# Altium schematic sheet SDMMC EMMC PCIE ADC Blocks.SchDoc
size 420 x 297 mm; SheetNumber: 6; SheetTotal: 26
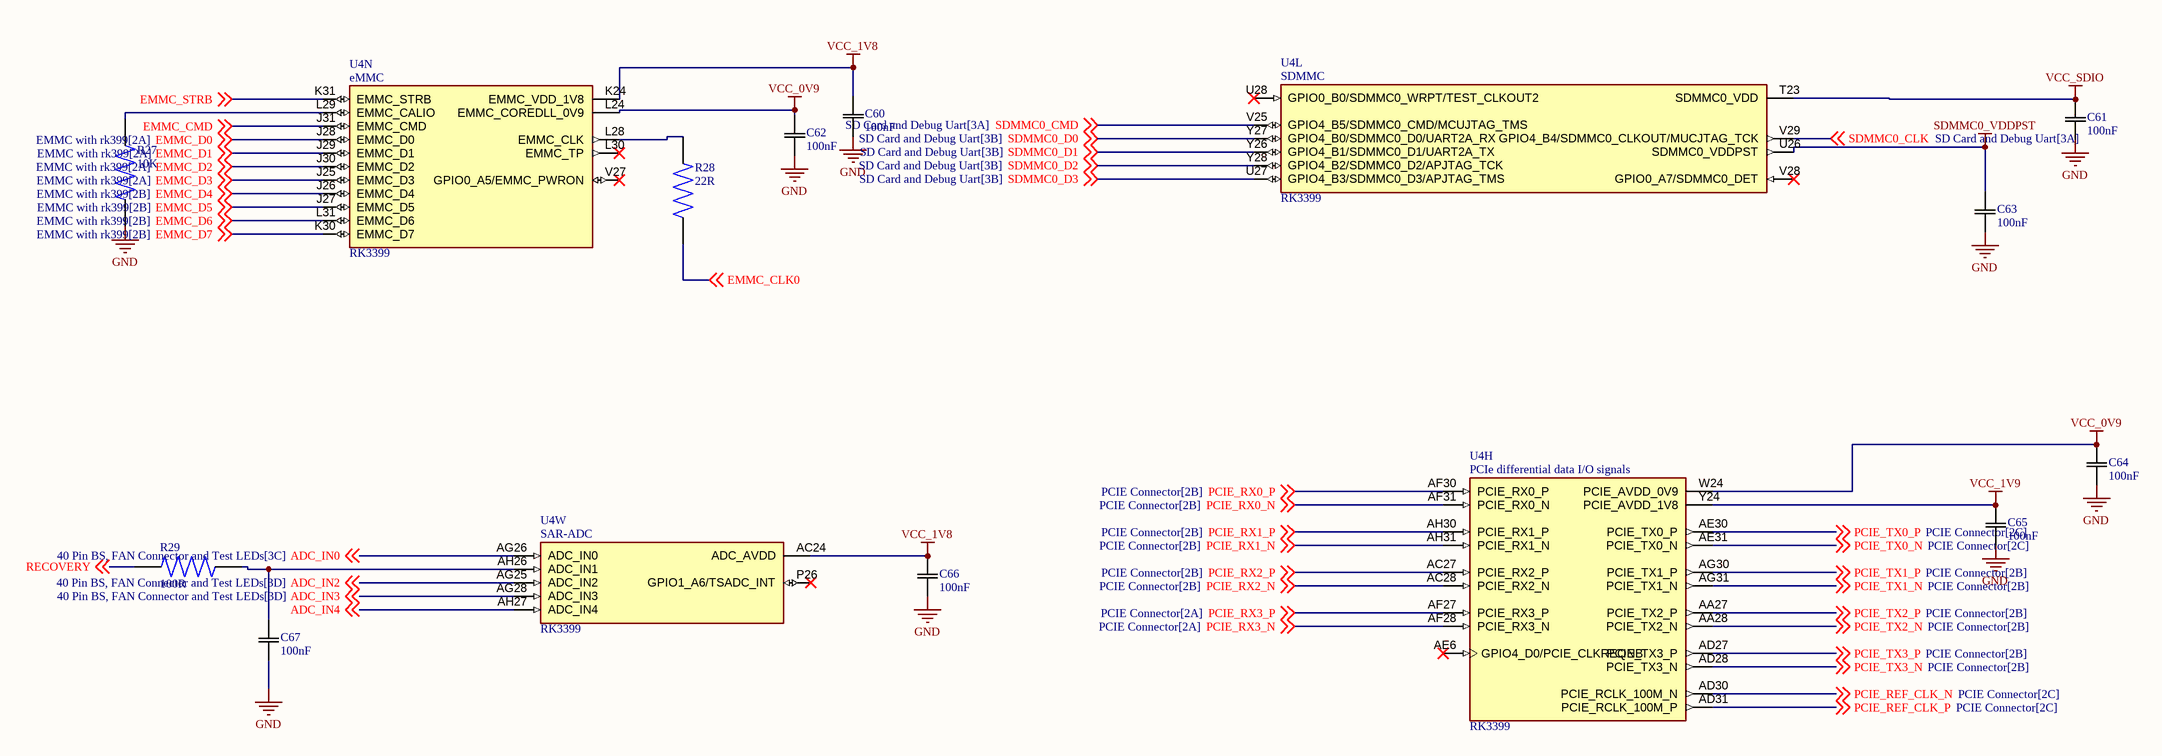
[diagram p0: SDMMC EMMC PCIE ADC Blocks.SchDoc]

## Parts
C60  100nF  [CAP_1005_TDK]
C61  100nF  [CAP_1005_TDK]
C62  100nF  [CAP_1005_TDK]
C63  100nF  [CAP_1005_TDK]
C64  100nF  [CAP_1005_TDK]
C65  100nF  [CAP_1005_TDK]
C66  100nF  [CAP_1005_TDK]
C67  100nF  [CAP_1005_TDK]
R27  10K  [RESC1608X55N]
R28  22R  [RES_ERJXGNJ220Y]
R29  100R  [RES_ERA6AHD330V]
U4  RK3399  [BGA828C65P31X31_2100X2100X161N]  (parts H,L,N,W of 32)

## Nets
GND: C60.2 C61.2 C62.2 C63.2 C64.2 C65.2 C66.2 C67.2 R27.1
SDMMC0_VDDPST: C63.1 U4.U26(SDMMC0_VDDPST)
VCC_0V9: C62.1 C64.1 U4.L24(EMMC_COREDLL_0V9) U4.W24(PCIE_AVDD_0V9)
VCC_1V8: C60.1 C66.1 U4.AC24(ADC_AVDD) U4.K24(EMMC_VDD_1V8)
VCC_1V9: C65.1 U4.Y24(PCIE_AVDD_1V8)
VCC_SDIO: C61.1 U4.T23(SDMMC0_VDD)
ADC_IN0: U4.AG26(ADC_IN0) ; off-sheet ADC_IN0
ADC_IN2: U4.AG25(ADC_IN2) ; off-sheet ADC_IN2
ADC_IN3: U4.AG28(ADC_IN3) ; off-sheet ADC_IN3
ADC_IN4: U4.AH27(ADC_IN4) ; off-sheet ADC_IN4
EMMC_CLK0: R28.1 ; off-sheet EMMC_CLK0
EMMC_CMD: U4.J31(EMMC_CMD) ; off-sheet EMMC_CMD
EMMC_D0: U4.J28(EMMC_D0) ; off-sheet EMMC_D0
EMMC_D1: U4.J29(EMMC_D1) ; off-sheet EMMC_D1
EMMC_D2: U4.J30(EMMC_D2) ; off-sheet EMMC_D2
EMMC_D3: U4.J25(EMMC_D3) ; off-sheet EMMC_D3
EMMC_D4: U4.J26(EMMC_D4) ; off-sheet EMMC_D4
EMMC_D5: U4.J27(EMMC_D5) ; off-sheet EMMC_D5
EMMC_D6: U4.L31(EMMC_D6) ; off-sheet EMMC_D6
EMMC_D7: U4.K30(EMMC_D7) ; off-sheet EMMC_D7
EMMC_STRB: U4.K31(EMMC_STRB) ; off-sheet EMMC_STRB
PCIE_REF_CLK_N: U4.AD30(PCIE_RCLK_100M_N) ; off-sheet PCIE_REF_CLK_N
PCIE_REF_CLK_P: U4.AD31(PCIE_RCLK_100M_P) ; off-sheet PCIE_REF_CLK_P
PCIE_RX0_N: U4.AF31(PCIE_RX0_N) ; off-sheet PCIE_RX0_N
PCIE_RX0_P: U4.AF30(PCIE_RX0_P) ; off-sheet PCIE_RX0_P
PCIE_RX1_N: U4.AH31(PCIE_RX1_N) ; off-sheet PCIE_RX1_N
PCIE_RX1_P: U4.AH30(PCIE_RX1_P) ; off-sheet PCIE_RX1_P
PCIE_RX2_N: U4.AC28(PCIE_RX2_N) ; off-sheet PCIE_RX2_N
PCIE_RX2_P: U4.AC27(PCIE_RX2_P) ; off-sheet PCIE_RX2_P
PCIE_RX3_N: U4.AF28(PCIE_RX3_N) ; off-sheet PCIE_RX3_N
PCIE_RX3_P: U4.AF27(PCIE_RX3_P) ; off-sheet PCIE_RX3_P
PCIE_TX0_N: U4.AE31(PCIE_TX0_N) ; off-sheet PCIE_TX0_N
PCIE_TX0_P: U4.AE30(PCIE_TX0_P) ; off-sheet PCIE_TX0_P
PCIE_TX1_N: U4.AG31(PCIE_TX1_N) ; off-sheet PCIE_TX1_N
PCIE_TX1_P: U4.AG30(PCIE_TX1_P) ; off-sheet PCIE_TX1_P
PCIE_TX2_N: U4.AA28(PCIE_TX2_N) ; off-sheet PCIE_TX2_N
PCIE_TX2_P: U4.AA27(PCIE_TX2_P) ; off-sheet PCIE_TX2_P
PCIE_TX3_N: U4.AD28(PCIE_TX3_N) ; off-sheet PCIE_TX3_N
PCIE_TX3_P: U4.AD27(PCIE_TX3_P) ; off-sheet PCIE_TX3_P
RECOVERY: R29.1 ; off-sheet RECOVERY
SDMMC0_CLK: U4.V29(GPIO4_B4/SDMMC0_CLKOUT/MUCJTAG_TCK) ; off-sheet SDMMC0_CLK
SDMMC0_CMD: U4.V25(GPIO4_B5/SDMMC0_CMD/MCUJTAG_TMS) ; off-sheet SDMMC0_CMD
SDMMC0_D0: U4.Y27(GPIO4_B0/SDMMC0_D0/UART2A_RX) ; off-sheet SDMMC0_D0
SDMMC0_D1: U4.Y26(GPIO4_B1/SDMMC0_D1/UART2A_TX) ; off-sheet SDMMC0_D1
SDMMC0_D2: U4.Y28(GPIO4_B2/SDMMC0_D2/APJTAG_TCK) ; off-sheet SDMMC0_D2
SDMMC0_D3: U4.U27(GPIO4_B3/SDMMC0_D3/APJTAG_TMS) ; off-sheet SDMMC0_D3
NetC67_1: C67.1 R29.2 U4.AH26(ADC_IN1)
NetR27_2: R27.2 U4.L29(EMMC_CALIO)
NetR28_2: R28.2 U4.L28(EMMC_CLK)

Not connected (* = marked no-connect by the designer): U4 AE6(GPIO4_D0/PCIE_CLKREQNB)* L30(EMMC_TP)* P26(GPIO1_A6/TSADC_INT)* U28(GPIO0_B0/SDMMC0_WRPT/TEST_CLKOUT2)* V27(GPIO0_A5/EMMC_PWRON)* V28(GPIO0_A7/SDMMC0_DET)*

## Notes on the sheet
- THIS DOCUMENT AND THE DATA DISCLOSED HEREIN OR
- HEREWITH IS THE PROPERTY OF ALTIUM LIMITED AND MAY
- DWG NO:
- REVISION
- REV:
- DESCRIPTION
- DATE
- APPROVED
- BE FREELY DISTRIBUTED IN WHOLE. NO RIGHTS ARE
- RESERVED OR EXPRESS OR IMPLIED WARANTEE GIVEN.
- ENG:
- APPROVALS
- PROJECT
- DSN:
- CHK:
- REFERENCE DOCUMENTS
- PROJECT REVISION:
- TITLE
- DOCUMENT REVISION:
- DESIGN ITEM:
- BOM:
- FAB DWG:
- PCB DWG:
- ASSY DWG:
- SCALE:
- A3
- SIZE
- CAGE CODE
- FILE NAME
- DWG NO.
- SHEET
- OF
- REV
- (in symbol RK3399, part H) PCIe differential data I/O signals
- (in symbol RK3399, part L) SDMMC
- (in symbol RK3399, part N) eMMC
- (in symbol RK3399, part W) SAR-ADC

## Library data of the parts
C60-C67 = C1005X7R1H104M050BB: Description; Manufacturer_Name: TDK; Copyright: Copyright (C) 2025 Ultra Librarian. All rights reserved.; Manufacturer_Part_Number: C1005X7R1H104M050BB
R27 = CR0603AFX-1002EAS: Resistor, AS 0603 10k 1% 100mW TC100 | Bourns CR0603AFX-1002EAS; SnapEDA_Link: https://www.snapeda.com/parts/CR0603AFX-1002EAS/Bourns/view-part/?ref=snap; Package: 0603-2 Bourns; Value: *; MF: Bourns; MP: CR0603AFX-1002EAS; Check_prices: https://www.snapeda.com/parts/CR0603AFX-1002EAS/Bourns/view-part/?ref=eda
R28 = ERJXGNJ220Y: MP: ERJXGNJ220Y; Package: None; Price: None; Availability: Unavailable; Value: *
R29 = ERA6AHD330V: Package: None; MP: ERA6AHD330V; Price: None; Value: *; Availability: Unavailable
U4 = RK3399: RK3399 ROCK Pi 4 Model A 2GB - ARMÂ® CortexÂ®-A53, CortexÂ®-A72 MPU Embedded Evaluation Board; MF: Rockchip; SnapEDA_Link: https://www.snapeda.com/parts/RK3399/Fuzhou+Rockchip+Electronics+Co/view-part/?ref=snap; Package: Seeed Technology; MP: RK3399; Check_prices: https://www.snapeda.com/parts/RK3399/Fuzhou+Rockchip+Electronics+Co/view-part/?ref=eda; Price: None; Value: *; Availability: Not in stock